# Altium schematic sheet Full_Bridge.SchDoc
size A4; SheetNumber: 1; SheetTotal: 2
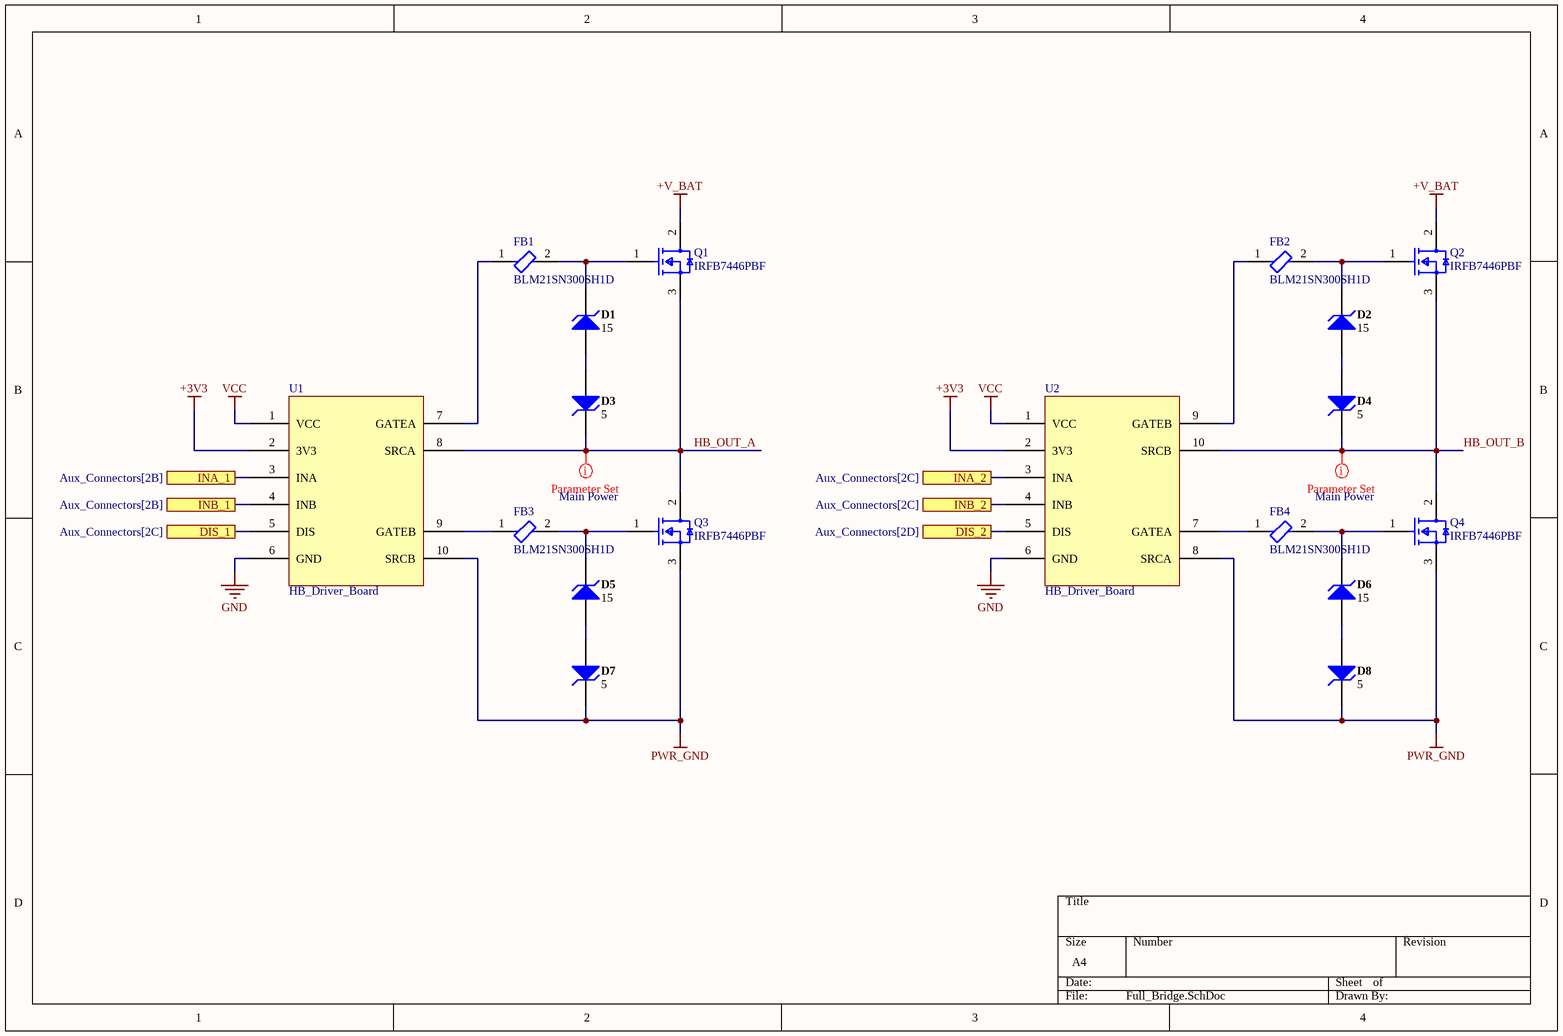
[diagram p0: Full_Bridge.SchDoc]

## Parts
D1  15  [VISH-SOD-123-2_V]
D2  15  [VISH-SOD-123-2_V]
D3  5  [VISH-SOD-123-2_V]
D4  5  [VISH-SOD-123-2_V]
D5  15  [VISH-SOD-123-2_V]
D6  15  [VISH-SOD-123-2_V]
D7  5  [VISH-SOD-123-2_V]
D8  5  [VISH-SOD-123-2_V]
FB1  BLM21SN300SH1D  [FP-BLM21-0_2-t0_85-e0_5-d-IPC_A]
FB2  BLM21SN300SH1D  [FP-BLM21-0_2-t0_85-e0_5-d-IPC_A]
FB3  BLM21SN300SH1D  [FP-BLM21-0_2-t0_85-e0_5-d-IPC_A]
FB4  BLM21SN300SH1D  [FP-BLM21-0_2-t0_85-e0_5-d-IPC_A]
Q1  IRFB7446PBF  [FP-PG-TO220-3-MFG]
Q2  IRFB7446PBF  [FP-PG-TO220-3-MFG]
Q3  IRFB7446PBF  [FP-PG-TO220-3-MFG]
Q4  IRFB7446PBF  [FP-PG-TO220-3-MFG]
U1  HB_Driver_Board  [HB_Driver]
U2  HB_Driver_Board  [HB_Driver]

## Ports
DIS_1 (see Aux_Connectors[2C]), DIS_2 (see Aux_Connectors[2D]), INA_1 (see Aux_Connectors[2B]), INA_2 (see Aux_Connectors[2C]), INB_1 (see Aux_Connectors[2B]), INB_2 (see Aux_Connectors[2C])

## Nets
+3V3: U1.2(3V3) U2.2(3V3)
+V_BAT: Q1.2(D) Q2.2(D)
GND: U1.6(GND) U2.6(GND)
PWR_GND: D7.2(K) D8.2(K) Q3.3(S) Q4.3(S) U1.10(SRCB) U2.8(SRCA)
VCC: U1.1(VCC) U2.1(VCC)
DIS_1: U1.5(DIS) ; port DIS_1
DIS_2: U2.5(DIS) ; port DIS_2
HB_OUT_A: D3.2(K) Q1.3(S) Q3.2(D) U1.8(SRCA)
HB_OUT_B: D4.2(K) Q2.3(S) Q4.2(D) U2.10(SRCB)
INA_1: U1.3(INA) ; port INA_1
INA_2: U2.3(INA) ; port INA_2
INB_1: U1.4(INB) ; port INB_1
INB_2: U2.4(INB) ; port INB_2
NetD1_1: D1.1(A) D3.1(A)
NetD1_2: D1.2(K) FB1.2 Q1.1(G)
NetD2_1: D2.1(A) D4.1(A)
NetD2_2: D2.2(K) FB2.2 Q2.1(G)
NetD5_1: D5.1(A) D7.1(A)
NetD5_2: D5.2(K) FB3.2 Q3.1(G)
NetD6_1: D6.1(A) D8.1(A)
NetD6_2: D6.2(K) FB4.2 Q4.1(G)
NetFB1_1: FB1.1 U1.7(GATEA)
NetFB2_1: FB2.1 U2.9(GATEB)
NetFB3_1: FB3.1 U1.9(GATEB)
NetFB4_1: FB4.1 U2.7(GATEA)

## Layout directives
net class Main Power: HB_OUT_A, HB_OUT_B

## Library data of the parts
D1 D2 D5 D6 = CMP-0931-00033-1: Small Signal Zener Diode, 15 V +/- 5%, -55 to 155 degC, 2-Pin SOD-123, RoHS, Tape and Reel; Manufacturer: Vishay Semiconductor; PartNumber: MMSZ5245B-E3-08; Int. Construction: Single; Test Current (IZT1) (mA): 8.5; Zener Impedance (IZT1) (Max.) (Ohm): 16; Power Dissipation (mW): 500; Tolerance: +/- 5%; PackageDescription: 2-Pin SMD, Body 2.7 x 1.55 mm, Height 1.35 mm; ComponentLink2Description: Datasheet; PackageVersion: Rev. 1.9; ComponentLink2URL: http://www.vishay.com/docs/85774/mmsz5225.pdf; RoHS: TRUE; Packing: Tape and Reel; Zener Voltage (NOM.) (V): 15; Operating Temperature: -55 to 150 degC; ComponentLink1Description: Manufacturer URL; ComponentLink3Description: Package Specification; PackageReference: SOD-123-2; DatasheetVersion: Rev. 1.9; ComponentLink3URL: http://www.vishay.com/docs/85774/mmsz5225.pdf; Mounting Technology: Surface Mount; ComponentLink1URL: http://www.vishay.com/
D3 D4 D7 D8 = CMP-0931-00024-1: Small Signal Zener Diode, 5.1 V +/- 5%, -55 to 155 degC, 2-Pin SOD-123, RoHS, Tape and Reel; Manufacturer: Vishay Semiconductor; PartNumber: MMSZ5231B-E3-08; Tolerance: +/- 5%; Test Current (IZT1) (mA): 20; Zener Impedance (IZT1) (Max.) (Ohm): 17; Zener Voltage (NOM.) (V): 5.1; Power Dissipation (mW): 500; Int. Construction: Single; RoHS: TRUE; PackageDescription: 2-Pin SMD, Body 2.7 x 1.55 mm, Height 1.35 mm; ComponentLink1Description: Manufacturer URL; Packing: Tape and Reel; Operating Temperature: -55 to 150 degC; PackageReference: SOD-123-2; Mounting Technology: Surface Mount; ComponentLink3URL: http://www.vishay.com/docs/85774/mmsz5225.pdf; ComponentLink3Description: Package Specification; ComponentLink2Description: Datasheet; DatasheetVersion: Rev. 1.9; PackageVersion: Rev. 1.9; ComponentLink2URL: http://www.vishay.com/docs/85774/mmsz5225.pdf; ComponentLink1URL: http://www.vishay.com/
FB1-FB4 = CMP-06046-001922-1: Chip Ferrite Bead, 0805, 30Ω @ 100MHz, 0.004Ω, ±10Ω, 8.5A; Number of Lines: 1; DC Resistance (DCR): 4mR; Packaging: Tape and Reel; Length: 0.079inch; Case Code (Metric): 2012; Max Operating Temperature: 125°C; Case Code (Imperial): 0805; Max Current Rating: 8.5A; Width: 0.049inch; Ratings: AEC-Q200; Height: 0.041inch; RoHS Compliant: Yes; Min Operating Temperature: -55°C; Package Quantity: 4000; Mount: Surface Mount; Case/Package: 0805
Q1-Q4 = CMP-32901-000256-1: MOSFET N-CH 40V 120A TO220AB; Rds On Max: 2.5mR; Input Capacitance: 4.73nF; Max Power Dissipation: 143W; Threshold Voltage: 3V; Lead Free: Lead Free; Number of Pins: 3; Max Operating Temperature: 175°C; Max Dual Supply Voltage: 40V; RoHS Compliant: Yes; Continuous Drain Current (ID): 120A; Packaging: Rail/Tube; Case/Package: TO-220; REACH SVHC: No SVHC; Min Operating Temperature: -55°C; Mount: Through Hole; Drain to Source Voltage (Vdss): 40V; Halogen Free: Halogen Free